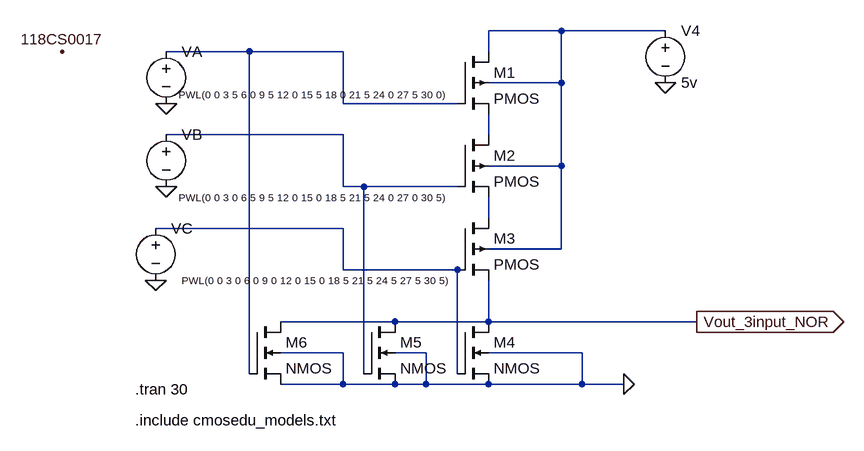
[diagram p0: schematic Draft5.asc]
Draft5.asc, the LTspice schematic file:
Version 4
SHEET 1 880 680
WIRE 320 0 208 0
WIRE 480 0 320 0
WIRE -160 32 -288 32
WIRE -16 32 -160 32
WIRE 208 32 208 0
WIRE 320 80 320 0
WIRE 320 80 208 80
WIRE -16 112 -16 32
WIRE 160 112 -16 112
WIRE -16 160 -288 160
WIRE 208 160 208 128
WIRE 320 208 320 80
WIRE 320 208 208 208
WIRE -16 240 -16 160
WIRE 16 240 -16 240
WIRE 160 240 16 240
WIRE 208 288 208 256
WIRE -16 304 -304 304
WIRE 320 336 320 208
WIRE 320 336 208 336
WIRE -16 368 -16 304
WIRE 160 368 -16 368
WIRE 64 448 -112 448
WIRE 208 448 208 384
WIRE 208 448 64 448
WIRE 528 448 208 448
WIRE -16 496 -112 496
WIRE 112 496 64 496
WIRE 352 496 208 496
WIRE -160 528 -160 32
WIRE 16 528 16 240
WIRE 160 528 160 368
WIRE -16 544 -16 496
WIRE -16 544 -112 544
WIRE 64 544 -16 544
WIRE 112 544 112 496
WIRE 112 544 64 544
WIRE 208 544 112 544
WIRE 352 544 352 496
WIRE 352 544 208 544
WIRE 416 544 352 544
FLAG -288 112 0
FLAG -288 240 0
FLAG -304 384 0
FLAG 480 80 0
FLAG 528 448 Vout_3input_NOR
IOPIN 528 448 Out
FLAG -448 32 118CS0017
FLAG 416 544 0
SYMBOL pmos4 160 32 R0
SYMATTR InstName M1
SYMBOL pmos4 160 160 R0
SYMATTR InstName M2
SYMBOL pmos4 160 288 R0
SYMATTR InstName M3
SYMBOL nmos4 160 448 R0
SYMATTR InstName M4
SYMBOL nmos4 16 448 R0
SYMATTR InstName M5
SYMBOL nmos4 -160 448 R0
SYMATTR InstName M6
SYMBOL voltage -288 16 R0
WINDOW 123 0 0 Left 0
WINDOW 39 0 0 Left 0
WINDOW 3 19 82 Left 1
SYMATTR Value PWL(0 0 3 5 6 0 9 5 12 0 15 5 18 0 21 5 24 0 27 5 30 0)
SYMATTR InstName VA
SYMBOL voltage -288 144 R0
WINDOW 123 0 0 Left 0
WINDOW 39 0 0 Left 0
WINDOW 3 19 113 Left 1
SYMATTR Value PWL(0 0 3 0 6 5 9 5 12 0 15 0 18 5 21 5 24 0 27 0 30 5)
SYMATTR InstName VB
SYMBOL voltage -304 288 R0
WINDOW 123 0 0 Left 0
WINDOW 39 0 0 Left 0
WINDOW 3 441 96 Right 1
SYMATTR Value PWL(0 0 3 0 6 0 9 0 12 0 15 0 18 5 21 5 24 5 27 5 30 5)
SYMATTR InstName VC
SYMBOL voltage 480 -16 R0
SYMATTR InstName V4
SYMATTR Value 5v
TEXT -336 552 Left 2 !.tran 30
TEXT -336 600 Left 2 !.include cmosedu_models.txt

The netlist it stands for:
* Draft5.asc
M1 N001 N002 N004 N001 PMOS
M2 N004 N003 N005 N001 PMOS
M3 N005 N006 Vout_3input_NOR N001 PMOS
M4 Vout_3input_NOR N006 0 0 NMOS
M5 Vout_3input_NOR N003 0 0 NMOS
M6 Vout_3input_NOR N002 0 0 NMOS
VA N002 0 PWL(0 0 3 5 6 0 9 5 12 0 15 5 18 0 21 5 24 0 27 5 30 0)
VB N003 0 PWL(0 0 3 0 6 5 9 5 12 0 15 0 18 5 21 5 24 0 27 0 30 5)
VC N006 0 PWL(0 0 3 0 6 0 9 0 12 0 15 0 18 5 21 5 24 5 27 5 30 5)
V4 N001 0 5v
.model NMOS NMOS
.model PMOS PMOS
.lib standard.mos
.tran 30
.include cmosedu_models.txt
.backanno
.end